# Altium schematic sheet Schematic.SchDoc
size A3; SheetNumber: 9; SheetTotal: 9
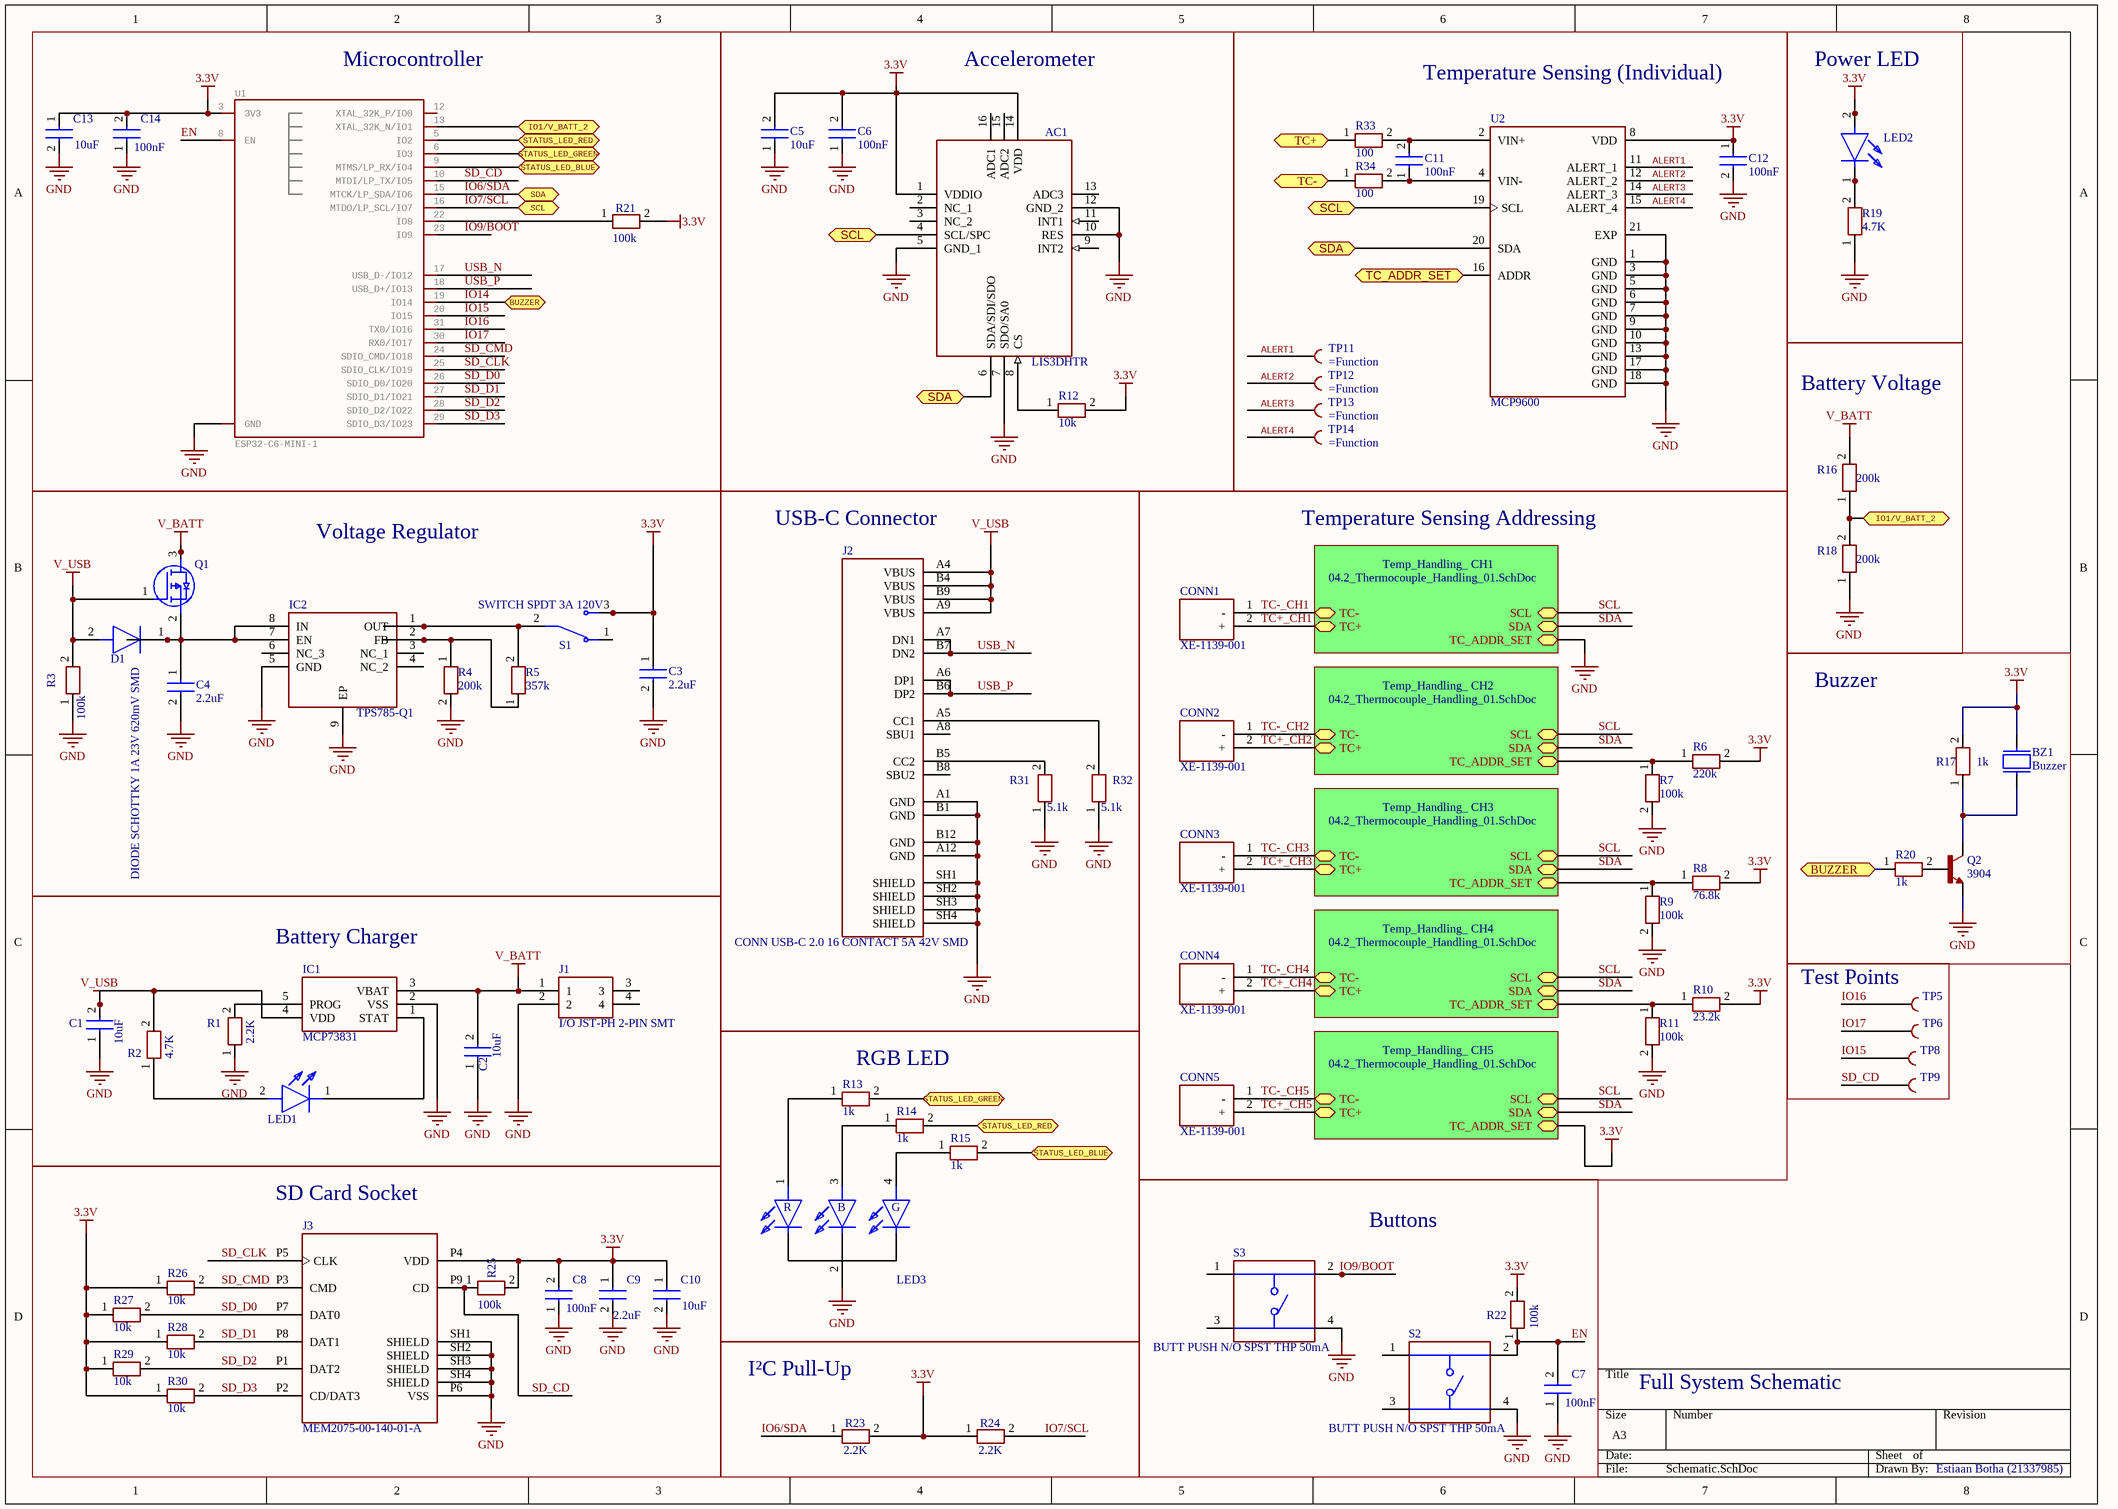
[diagram p0: Schematic.SchDoc]

## Parts
AC1  LIS3DHTR  [LIS3DHTR]
BZ1  Buzzer  [3XDCR_PS1240P02CT3]
C1  10uF  [CAPC2012X94N]
C2  10uF  [CAPC2012X94N]
C3  2.2uF  [CAPC2012X135N]
C4  2.2uF  [CAPC2012X135N]
C5  10uF  [CAPC2012X94N]
C6  100nF  [CAPC2012X94N]
C7  100nF  [CAPC2012X94N]
C8  100nF  [CAPC2012X94N]
C9  2.2uF  [CAPC2012X135N]
C10  10uF  [CAPC2012X94N]
C11  100nF  [CAPC2012X94N]
C12  100nF  [CAPC2012X94N]
C13  10uF  [CAPC2012X94N]
C14  100nF  [CAPC2012X94N]
CONN1  XE-1139-001  [AM-K PCB XE-1139-001]
CONN2  XE-1139-001  [AM-K PCB XE-1139-001]
CONN3  XE-1139-001  [AM-K PCB XE-1139-001]
CONN4  XE-1139-001  [AM-K PCB XE-1139-001]
CONN5  XE-1139-001  [AM-K PCB XE-1139-001]
D1  DIODE SCHOTTKY 1A 23V 620mV SMD  [SOD2512X113N]
IC1  MCP73831  [SOT95P270X145-5N]
IC2  TPS785-Q1  [SON65P300X300X100-9N-D]
J1  I/O JST-PH 2-PIN SMT  [1769]
J2  CONN USB-C 2.0 16 CONTACT 5A 42V SMD  [CUI_UJ20-C-H-G-SMT-TR]
J3  MEM2075-00-140-01-A  [GCT_MEM2075-00-140-01-A]
LED1  LED YELLOW 0805 SMD  [LYM676Q2S126Z]  (value not drawn)
LED2  LED YELLOW 0805 SMD  [LYM676Q2S126Z]  (value not drawn)
LED3  LED RGB THP SRAIGHT-LEG  [LED THP Dialight 521-8559F]  (value not drawn)
Q1  MOSFET P-CH ENH FET -20V 52mOh -5A SMD  [SOT96P240X115-3N]  (value not drawn)
Q2  3904  [SOT95P230X110-3N]
R1  2.2K  [RESC2012X70N]
R2  4.7K  [RESC2012X50N]
R3  100k  [RESC2012X50N]
R4  200k  [RESC2012X60N]
R5  357k  [ERJ6ENF1000V]
R6  220k  [RESC2012X60N]
R7  100k  [RESC2012X50N]
R8  76.8k  [RESC2012X60N]
R9  100k  [RESC2012X50N]
R10  23.2k  [RESC2012X60N]
R11  100k  [RESC2012X50N]
R12  10k  [RESC2012X60N]
R13  1k  [RESC2012X60N]
R14  1k  [RESC2012X60N]
R15  1k  [RESC2012X60N]
R16  200k  [RESC2012X60N]
R17  1k  [RESC2012X60N]
R18  200k  [RESC2012X60N]
R19  4.7K  [RESC2012X50N]
R20  1k  [RESC2012X60N]
R21  100k  [RESC2012X50N]
R22  100k  [RESC2012X50N]
R23  2.2K  [RESC2012X70N]
R24  2.2K  [RESC2012X70N]
R25  100k  [RESC2012X50N]
R26  10k  [RESC2012X60N]
R27  10k  [RESC2012X60N]
R28  10k  [RESC2012X60N]
R29  10k  [RESC2012X60N]
R30  10k  [RESC2012X60N]
R31  5.1k  [RESC2012X60N]
R32  5.1k  [RESC2012X60N]
R33  100  [RESC2012X60N]
R34  100  [RESC2012X60N]
S1  SWITCH SPDT 3A 120V  [SW_500ASSP1M6QE]
S2  BUTT PUSH N/O SPST THP 50mA  [SW_TS02-66-43-BK-100-LCR-D]
S3  BUTT PUSH N/O SPST THP 50mA  [SW_TS02-66-43-BK-100-LCR-D]
TP5  (no value)  [TP_Pad_TH_1.2P_0.6H]  (no BOM)
TP6  (no value)  [TP_Pad_TH_1.2P_0.6H]  (no BOM)
TP8  (no value)  [TP_Pad_TH_1.2P_0.6H]  (no BOM)
TP9  (no value)  [TP_Pad_TH_1.2P_0.6H]  (no BOM)
TP11  (no value)  [TP_Pad_TH_1.2P_0.6H]  (no BOM)
TP12  (no value)  [TP_Pad_TH_1.2P_0.6H]  (no BOM)
TP13  (no value)  [TP_Pad_TH_1.2P_0.6H]  (no BOM)
TP14  (no value)  [TP_Pad_TH_1.2P_0.6H]  (no BOM)
U1  ESP32-C6-MINI-1  [ESP32C6MINI1H8]
U2  MCP9600  [QFN65P500X500X100-21N]

## Blocks framed on the sheet
Microcontroller: C13 C14 R21 U1
Accelerometer: AC1 C5 C6 R12
Temperature Sensing (Individual): C11 C12 R33 R34 TP11-TP14 U2
Power LED: LED2 R19
Battery Voltage: R16 R18
Voltage Regulator: C3 C4 D1 IC2 Q1 R3-R5 S1
USB-C Connector: J2 R31 R32
Temperature Sensing Addressing: CONN1-CONN5 R6-R11
Buzzer: BZ1 Q2 R17 R20
Battery Charger: C1 C2 IC1 J1 LED1 R1 R2
Test Points: TP5 TP6 TP8 TP9
RGB LED: LED3 R13-R15
SD Card Socket: C8-C10 J3 R25-R30
Buttons: C7 R22 S2 S3
I²C Pull-Up: R23 R24

## Sub-sheets
Temp_Handling_ CH1 = 04.2_Thermocouple_Handling_01.SchDoc: TC+ (bidir), TC- (bidir), SCL (bidir), SDA (bidir), TC_ADDR_SET (bidir)
Temp_Handling_ CH2 = 04.2_Thermocouple_Handling_01.SchDoc: TC+ (bidir), TC- (bidir), SCL (bidir), SDA (bidir), TC_ADDR_SET (bidir)
Temp_Handling_ CH3 = 04.2_Thermocouple_Handling_01.SchDoc: TC+ (bidir), TC- (bidir), SCL (bidir), SDA (bidir), TC_ADDR_SET (bidir)
Temp_Handling_ CH4 = 04.2_Thermocouple_Handling_01.SchDoc: TC+ (bidir), TC- (bidir), SCL (bidir), SDA (bidir), TC_ADDR_SET (bidir)
Temp_Handling_ CH5 = 04.2_Thermocouple_Handling_01.SchDoc: TC+ (bidir), TC- (bidir), SCL (bidir), SDA (bidir), TC_ADDR_SET (bidir)

## Ports
BUZZER (bidir, see 01_Top[3C], 05_Human_Interaction[1C]), BUZZER (bidir, see 01_Top[3C], 06_MCU[6D]), IO1/V_BATT_2 (bidir, see 01_Top[3B], 05_Human_Interaction[2B]), IO1/V_BATT_2 (bidir, see 01_Top[3B], 06_MCU[6E]), SCL (bidir, see 01_Top[2C], 03_Temp_Sensor[4B], 04.2_Thermocouple_Handling_01[2B], 04_Accelerometer[3B]), SCL (bidir, see 01_Top[2C], 03_Temp_Sensor[4B], 04.2_Thermocouple_Handling_01[2B], 06_MCU[6D]), SCL (bidir, see 03_Temp_Sensor[2B], 03_Temp_Sensor[4B], 04_Accelerometer[3B], 06_MCU[6D]), SDA (bidir, see 01_Top[2C], 03_Temp_Sensor[4B], 04.2_Thermocouple_Handling_01[2B], 04_Accelerometer[3C]), SDA (bidir, see 01_Top[2C], 03_Temp_Sensor[4B], 04.2_Thermocouple_Handling_01[2B], 06_MCU[6D]), SDA (bidir, see 03_Temp_Sensor[2B], 03_Temp_Sensor[4B], 04_Accelerometer[3C], 06_MCU[6D]), STATUS_LED_BLUE (bidir, see 01_Top[3B], 05_Human_Interaction[4B]), STATUS_LED_BLUE (bidir, see 01_Top[3B], 06_MCU[6E]), STATUS_LED_GREEN (bidir, see 01_Top[3B], 05_Human_Interaction[4B]), STATUS_LED_GREEN (bidir, see 01_Top[3B], 06_MCU[6E]), STATUS_LED_RED (bidir, see 01_Top[3B], 05_Human_Interaction[4B]), STATUS_LED_RED (bidir, see 01_Top[3B], 06_MCU[6E]), TC+ (bidir, see 03_Temp_Sensor[2B]), TC- (bidir, see 03_Temp_Sensor[2B]), TC_ADDR_SET (bidir, see 03_Temp_Sensor[2B])

## Nets
3.3V: AC1.1(VDDIO) AC1.14(VDD) BZ1.2 C3.1 C5.2 C6.2 C8.2 C9.1 C10.1 C12.1 C13.1 C14.2 J3.P4(VDD) LED2.2(A) R6.2 R8.2 R10.2 R12.2 R17.2 R21.2 R22.2 R23.2 R24.1 R25.2 R26.1 R27.1 R28.1 R29.1 R30.1 S1.3(NO) U1.3(3V3) U2.8(VDD) ; sheet Temp_Handling_ CH5/TC_ADDR_SET
GND: AC1.5(GND_1) AC1.7(SDO/SA0) AC1.10(RES) AC1.12(GND_2) C1.1 C2.1 C3.2 C4.2 C5.1 C6.1 C7.1 C8.1 C9.2 C10.2 C12.2 C13.2 C14.1 IC1.2(VSS) IC2.5(GND) IC2.9(EP) J1.2 J2.A1(GND) J2.A12(GND) J2.B1(GND) J2.B12(GND) J2.SH1(SHIELD) J2.SH2(SHIELD) J2.SH3(SHIELD) J2.SH4(SHIELD) J3.P6(VSS) J3.SH1(SHIELD) J3.SH2(SHIELD) J3.SH3(SHIELD) J3.SH4(SHIELD) LED3.2 Q2.E R1.1 R3.1 R4.2 R7.2 R9.2 R11.2 R18.1 R19.1 R31.1 R32.1 S2.4 S3.4 U1.1(GND) U2.1(GND) U2.3(GND) U2.5(GND) U2.6(GND) U2.7(GND) U2.9(GND) U2.10(GND) U2.13(GND) U2.17(GND) U2.18(GND) U2.21(EXP) ; sheet Temp_Handling_ CH1/TC_ADDR_SET
V_BATT: C2.2 IC1.3(VBAT) J1.1 Q1.3(D) R16.2
V_USB: C1.2 D1.2(A) IC1.4(VDD) J2.A4(VBUS) J2.A9(VBUS) J2.B4(VBUS) J2.B9(VBUS) Q1.1(G) R2.2 R3.2
ALERT1: TP11.TP U2.11(ALERT_1)
ALERT2: TP12.TP U2.12(ALERT_2)
ALERT3: TP13.TP U2.14(ALERT_3)
ALERT4: TP14.TP U2.15(ALERT_4)
EN: C7.2 R22.1 S2.2 U1.8(EN)
IO1/V_BATT_2: R16.1 R18.2 U1.13(XTAL_32K_N/IO1) ; port IO1/V_BATT_2
IO6/SDA: AC1.6(SDA/SDI/SDO) R23.1 U1.15(MTCK/LP_SDA/IO6) U2.20(SDA) ; port SDA
IO7/SCL: AC1.4(SCL/SPC) R24.2 U1.16(MTDO/LP_SCL/IO7) U2.19(SCL) ; port SCL
IO9/BOOT: S3.2 U1.23(IO9)
IO14: R20.1 U1.19(IO14) ; port BUZZER
IO15: TP8.TP U1.20(IO15)
IO16: TP5.TP U1.31(TX0/IO16)
IO17: TP6.TP U1.30(RX0/IO17)
SCL: sheet Temp_Handling_ CH1/SCL, sheet Temp_Handling_ CH2/SCL, sheet Temp_Handling_ CH3/SCL, sheet Temp_Handling_ CH4/SCL, sheet Temp_Handling_ CH5/SCL
SD_CD: J3.P9(CD) R25.1 TP9.TP U1.10(MTDI/LP_TX/IO5)
SD_CLK: J3.P5(CLK) U1.25(SDIO_CLK/IO19)
SD_CMD: J3.P3(CMD) R26.2 U1.24(SDIO_CMD/IO18)
SD_D0: J3.P7(DAT0) R27.2 U1.26(SDIO_D0/IO20)
SD_D1: J3.P8(DAT1) R28.2 U1.27(SDIO_D1/IO21)
SD_D2: J3.P1(DAT2) R29.2 U1.28(SDIO_D2/IO22)
SD_D3: J3.P2(CD/DAT3) R30.2 U1.29(SDIO_D3/IO23)
SDA: sheet Temp_Handling_ CH1/SDA, sheet Temp_Handling_ CH2/SDA, sheet Temp_Handling_ CH3/SDA, sheet Temp_Handling_ CH4/SDA, sheet Temp_Handling_ CH5/SDA
STATUS_LED_BLUE: R15.2 U1.9(MTMS/LP_RX/IO4) ; port STATUS_LED_BLUE
STATUS_LED_GREEN: R13.2 U1.6(IO3) ; port STATUS_LED_GREEN
STATUS_LED_RED: R14.2 U1.5(IO2) ; port STATUS_LED_RED
TC+: R33.1 ; port TC+
TC+_CH1: CONN1.2(+) ; sheet Temp_Handling_ CH1/TC+
TC+_CH2: CONN2.2(+) ; sheet Temp_Handling_ CH2/TC+
TC+_CH3: CONN3.2(+) ; sheet Temp_Handling_ CH3/TC+
TC+_CH4: CONN4.2(+) ; sheet Temp_Handling_ CH4/TC+
TC+_CH5: CONN5.2(+) ; sheet Temp_Handling_ CH5/TC+
TC-: R34.1 ; port TC-
TC-_CH1: CONN1.1(-) ; sheet Temp_Handling_ CH1/TC-
TC-_CH2: CONN2.1(-) ; sheet Temp_Handling_ CH2/TC-
TC-_CH3: CONN3.1(-) ; sheet Temp_Handling_ CH3/TC-
TC-_CH4: CONN4.1(-) ; sheet Temp_Handling_ CH4/TC-
TC-_CH5: CONN5.1(-) ; sheet Temp_Handling_ CH5/TC-
TC_ADDR_SET: U2.16(ADDR) ; port TC_ADDR_SET
USB_N: J2.A7(DN1) J2.B7(DN2) U1.17(USB_D-/IO12)
USB_P: J2.A6(DP1) J2.B6(DP2) U1.18(USB_D+/IO13)
NetAC1_8: AC1.8(CS) R12.1
NetBZ1_1: BZ1.1 Q2.C R17.1
NetC4_1: C4.1 D1.1(K) IC2.7(EN) IC2.8(IN) Q1.2(S)
NetC11_1: C11.1 R34.2 U2.4(VIN-)
NetC11_2: C11.2 R33.2 U2.2(VIN+)
NetIC1_1: IC1.1(STAT) LED1.1(K)
NetIC1_5: IC1.5(PROG) R1.2
NetIC2_1: IC2.1(OUT) R5.2 S1.2(COM)
NetIC2_2: IC2.2(FB) R4.1 R5.1
NetJ2_A5: J2.A5(CC1) R32.2
NetJ2_B5: J2.B5(CC2) R31.2
NetLED1_2: LED1.2(A) R2.1
NetLED2_1: LED2.1(K) R19.2
NetLED3_1: LED3.1(K) R13.1
NetLED3_3: LED3.3(K) R14.1
NetLED3_4: LED3.4(K) R15.1
NetQ2_B: Q2.B R20.2
NetR6_1: R6.1 R7.1 ; sheet Temp_Handling_ CH2/TC_ADDR_SET
NetR8_1: R8.1 R9.1 ; sheet Temp_Handling_ CH3/TC_ADDR_SET
NetR10_1: R10.1 R11.1 ; sheet Temp_Handling_ CH4/TC_ADDR_SET
NetR21_1: R21.1 U1.22(IO8)

Not connected (* = marked no-connect by the designer): AC1 2(NC_1) 3(NC_2) 9(INT2) 11(INT1) 13(ADC3) 15(ADC2) 16(ADC1); IC2 3(NC_1) 4(NC_2) 6(NC_3); J1 3 4; J2 A8(SBU1) B8(SBU2); S1 1(NC); S2 1 3; S3 1 3; U1 12(XTAL_32K_P/IO0)

## Notes on the sheet
- Full System Schematic
- Estiaan Botha (21337985)
- (in symbol LED RGB THP SRAIGHT-LEG) R; B; G

## Library data of the parts
AC1 = IC ACC MEMS 3-AXIS 11uA SMD: Accelerometer; Manufacturer_Part_Number: LIS3DHTR; ComponentLink1Description: Datasheet; ComponentLink1URL: https://www.mouser.co.za/datasheet/2/389/lis3dh-1849589.pdf
BZ1 = INDICATOR BUZZER PIEZO PS1240P02CT3: Buzzers Transducer, Externally Driven Piezo 3V 4kHz 60dB @ 3V, 10cm Through Hole PC Pins; Manufacturer_Part_Number: PS1240P02CT3; ComponentLink1Description: Datasheet; ComponentLink1URL: https://product.tdk.com/system/files/dam/doc/product/sw_piezo/sw_piezo/piezo-buzzer/catalog/piezoelectronic_buzzer_ps_en.pdf
C1 C2 C5 C10 C13 = CAP CER 10uF 0805 SMD: Capacitor; Manufacturer_Part_Number: CL21A106KOQNNNE; ComponentLink1Description: Datasheet; ComponentLink1URL: https://www.mouser.co.za/datasheet/2/585/MLCC-1837944.pdf
C3 C4 C9 = CAP CER 2u2F 0805 SMD: Capacitor; Manufacturer_Part_Number: LMK212BJ225MG-T
C6-C8 C11 C12 C14 = CAP CER 100nF 0805 SMD: Capacitor; Manufacturer_Part_Number: 08055C104KAZ2A; ComponentLink1Description: Datasheet; ComponentLink1URL: http://datasheets.avx.com/X7RDielectric.pdf
CONN1-CONN5 = CONN AM-K-PCB XE-1139-001: Thermocouple Type-K Connector; Manufacturer_Part_Number: XE-1139-001; Supplier: DigiKey; ComponentLink1Description: Datasheet; ComponentLink1URL: https://mm.digikey.com/Volume0/opasdata/d220001/medias/docus/6465/XE-1139-001.pdf
D1 = DIODE SCHOTTKY 1A 23V 620mV SMD: Diode; Manufacturer_Part_Number: BAT20JFILM; ComponentLink1Description: Datasheet; ComponentLink1URL: http://www.st.com/web/en/resource/technical/document/datasheet/CD00012201.pdf
IC1 = IC BATT CHG MGNT Li-Po 4V2 REG SMD: Integrated Circuit; Manufacturer_Part_Number: MCP73831T-2ACI/OT; ComponentLink1Description: Datasheet; ComponentLink1URL: http://ww1.microchip.com/downloads/en/DeviceDoc/20001984g.pdf
IC2 = IC LDO 1A 5V5 ADJ SMD SON-8: LDO Voltage Regulators Automotive 1-A high -accuracy adjustable; Manufacturer_Part_Number: TPS78501QWDRBRQ1; ComponentLink1Description: Datasheet; ComponentLink1URL: https://www.ti.com/lit/gpn/TPS785-Q1
J1 = I/O JST-PH 2-PIN SMT: Connector; Manufacturer_Part_Number: 1769
J2 = CONN USB-C 2.0 16 CONTACT 5A 42V SMD: USB Connectors Type C,2.0, Horizontal, Gold plated 3u, Mid Surface Mount 1.0mm, 16 pin, T&R; Manufacturer_Part_Number: UJ20-C-H-G-SMT-TR; ComponentLink1Description: Datasheet; ComponentLink1URL: https://www.sameskydevices.com/product/resource/uj20-c-h-g-smt-tr.pdf
J3 = SD CARD SOCKET SMD MEM2075-00-140-01-A: 9 (8 + 1) Position Card Connector microSD Surface Mount, Right Angle Gold; ComponentLink1Description: Datasheet; ComponentLink1URL: https://www.mouser.co.za/datasheet/2/837/MEM2075-2887971.pdf; Manufacturer_Part_Number: MEM2075-00-140-01-A
LED1 LED2 = LED YELLOW 0805 SMD: Single Colour LED Yellow 20mA; Manufacturer_Part_Number: LY M676-Q2S1-26-Z; ComponentLink1Description: Datasheet; ComponentLink1URL: https://www.mouser.com/datasheet/2/588/Osram_7222021_LY__M676_EN-2891431.pdf
LED3 = LED RGB THP SRAIGHT-LEG: RGB LED Dialight 521-8559F; Manufacturer_Part_Number: 521-8559F; ComponentLink1Description: Datasheet; ComponentLink1URL: https://www.mouser.co.za/datasheet/2/109/C18455B-1843429.pdf
Q1 = MOSFET P-CH ENH FET -20V 52mOh -5A SMD: MOSFET (P-Channel); Manufacturer_Part_Number: DMG2305UX-7; ComponentLink1Description: Datasheet; ComponentLink1URL: https://www.diodes.com/assets/Datasheets/DMG2305UX.pdf
Q2 = BJT NPN 3904 SMD SOT-23: NPN SMALL SIGNAL SURFACE MOUNT TRANSISTOR; Manufacturer_Part_Number: MMBT3904
R1 R23 R24 = RES 2.2K 0805 SMD: Resistor; Manufacturer_Part_Number: ERJ-PB6B2201V
R2 R19 = RES 4.7K 0805 SMD: Resistor; Manufacturer_Part_Number: CRCW08054K70FKEA
R3 R7 R9 R11 R21 R22 R25 = RES 100K 0805 SMD: Resistor; Manufacturer_Part_Number: CRCW0805100KJNECC
R4 R16 R18 = RES 200K 0805 SMD: Resistor; Manufacturer_Part_Number: SG73P2ATTD2003F
R5 = RES 357K 0805 SMD: Resistor; Manufacturer_Part_Number: ERJ-6ENF3573V; ComponentLink1Description: Datasheet; ComponentLink1URL: https://industrial.panasonic.com/cdbs/www-data/pdf/RDA0000/AOA0000C84.pdf
R6 = RES 220K 0805 SMD: Resistor; Manufacturer_Part_Number: CR0805-FX-2203ELF
R8 = RES 76.8K 0805 SMD: Resistor; Manufacturer_Part_Number: RC0805FR-0776K8L; ComponentLink1Description: Datasheet; ComponentLink1URL: https://industrial.panasonic.com/cdbs/www-data/pdf/RDA0000/AOA0000C84.pdf
R10 = RES 23.2K 0805 SMD: Resistor; Manufacturer_Part_Number: RC0805FR-0723K2L; ComponentLink1Description: Datasheet; ComponentLink1URL: https://industrial.panasonic.com/cdbs/www-data/pdf/RDA0000/AOA0000C84.pdf
R12 R26-R30 = RES 10K 0805 SMD: Resistor; Manufacturer_Part_Number: CR0805-FX-1002ELF
R13-R15 R17 R20 = RES 1K 0805 SMD: Resistor; Manufacturer_Part_Number: RC0805JR-071KL
R31 R32 = RES 5.1K 0805 SMD: Resistor; Manufacturer_Part_Number: RC0805JR-075K1L; ComponentLink1Description: Datasheet; ComponentLink1URL: https://industrial.panasonic.com/cdbs/www-data/pdf/RDA0000/AOA0000C84.pdf
R33 R34 = RES 100 0805 SMD: Resistor; Manufacturer_Part_Number: 1623096-1
S1 = SWITCH SPDT 3A 120V: Manufacturer_Part_Number: 500ASSP1M6QE
S2 S3 = BUTT PUSH N/O SPST THP 50mA: 6 x 6 mm, 4.3 mm Actuator Height, 100 gf, Black, Long Crimped, Through Hole, SPST, Tactile Switch; Manufacturer_Part_Number: TS02-66-43-BK-100-LCR-D
TP5 TP6 TP8 TP9 TP11-TP14 = TP 1.5mm PAD
U1 = ESP32-C6-MINI-1: Manufacturer_Part_Number: ESP32-C6-MINI-1-H8; ComponentLink1Description: Datasheet; ComponentLink1URL: https://www.mouser.com/catalog/specsheets/Espressif_Systems_esp32-c6-mini-1_mini-1u_datasheet_en.pdf?_gl=1*7278yr*_gcl_aw*R0NMLjE3Mzk0MzM2MTQuQ2p3S0NBaUFxckc5QmhBVkVpd0FhUHU1emlsTWRuRXdaa2Fsd2VWNEN5MzNjMjVBX1BkRDhocTJZbnRtek0tckw4Q0pVVXJTcmNRbGdob0NCcXNRQXZEX0J3RQ..*_gcl_au*ODgyNzE3NTQxLjE3NDEwOTkzMzU.*_ga*MjEzMDEzNzc2Mi4xNzMzMzA0NDkw*_ga_15W4STQT4T*MTc0MTUxNTkxNS42MC4xLjE3NDE1MTgwNDEuMzcuMC4w
U2 = IC TYPE_K AMP I2Q MCP9600-I/MX SMD: MCP9600 Series Thermocouple Electromotive Force to Â±1.5Â°C Converter - VQFN-2; Manufacturer_Part_Number: MCP9600-E/MX; ComponentLink1Description: Datasheet; ComponentLink1URL: https://www.mouser.co.za/datasheet/2/268/MCP960X_L0X_RL0X_Thermocouple_EMF_to_Temperature_C-3443378.pdf